# Altium project 光照度计.PrjPCB
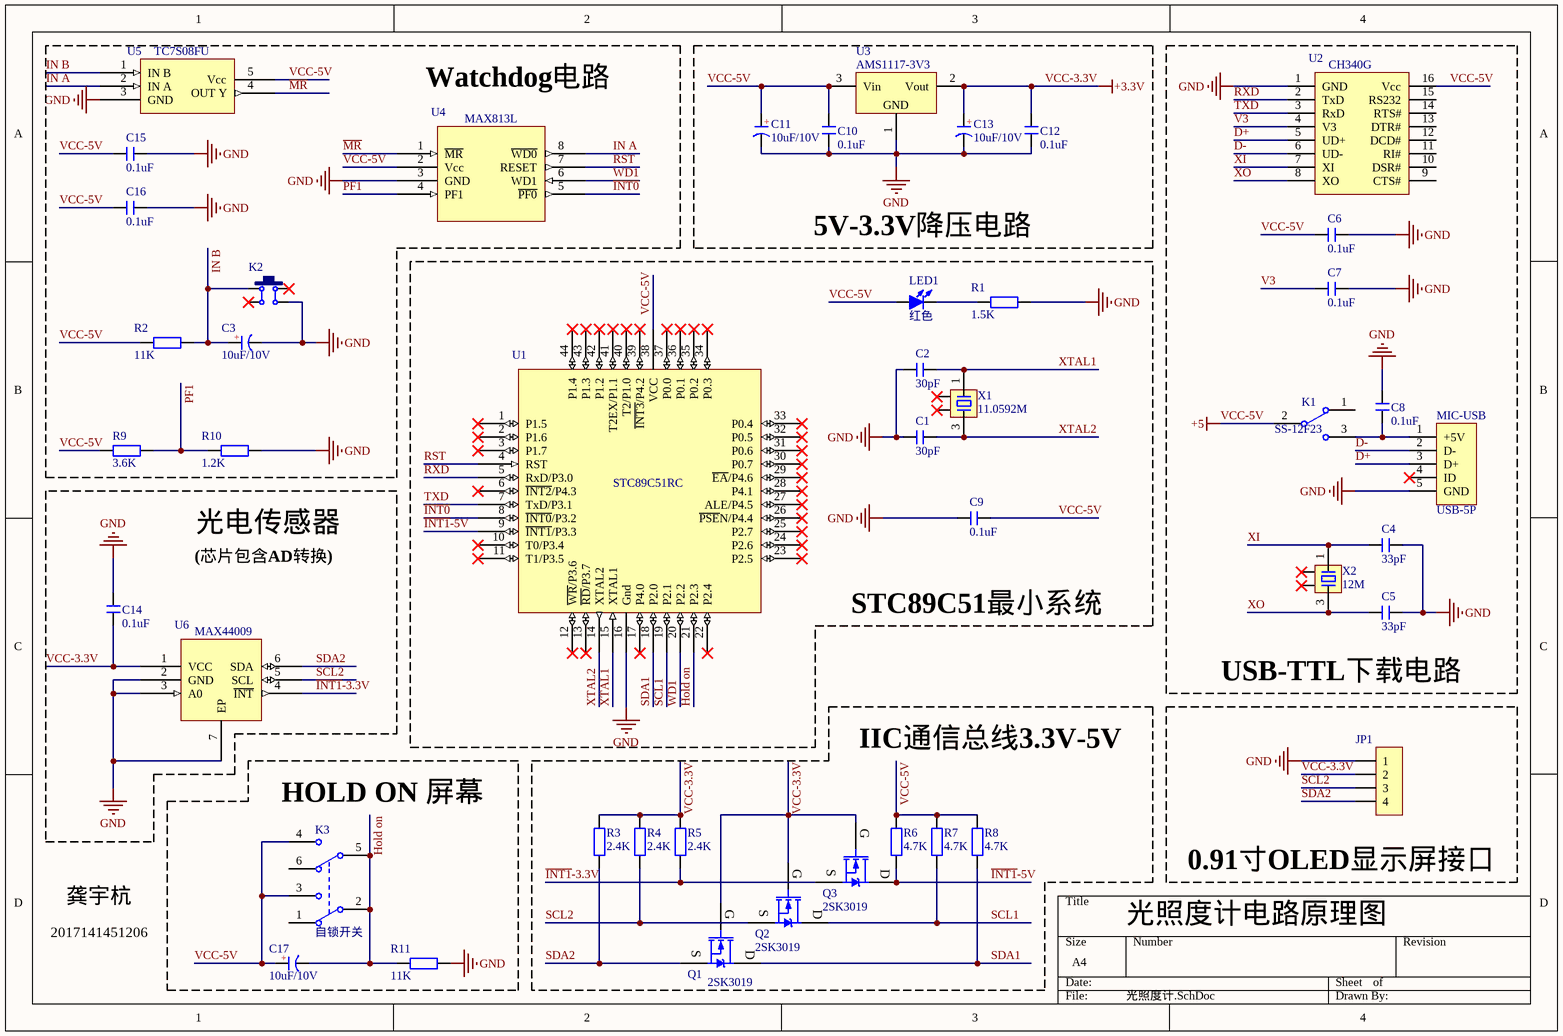
[diagram p0: 光照度计.SchDoc]
1 sheet, 45 parts. Net scope: global (net labels, ports and power ports of the same name join across sheets).
Board file: 光照度计.PcbDoc

## Sheet 光照度计.SchDoc
size A4

### Parts
C1  30pF  [C 0805_L]
C2  30pF  [C 0805_L]
C3  10uF/10V  [CM A(3*5.4)]
C4  33pF  [C 0805_L]
C5  33pF  [C 0805_L]
C6  0.1uF  [C 0805_L]
C7  0.1uF  [C 0805_L]
C8  0.1uF  [C 0805_L]
C9  0.1uF  [C 0805_L]
C10  0.1uF  [C 0805_L]
C11  10uF/10V  [CM A(3*5.4)]
C12  0.1uF  [C 0805_L]
C13  10uF/10V  [CM A(3*5.4)]
C14  0.1uF  [C 0805_L]
C15  0.1uF  [C 0805_L]
C16  0.1uF  [C 0805_L]
C17  10uF/10V  [CM A(3*5.4)]
JP1  HDR-1X4  [HDR2.54-M-LI-4P]  (value not drawn)
K1  SS-12F23  [MSK-12C01-07]
K2  6x6x5  [TSW SMD-6*6*4.3]  (value not drawn)
K3  自锁开关  [KFT DIP-7X7]
LED1  红色  [LED 0805G]
MIC-USB  USB-5P  [USB-MICRO_A]
Q1  2SK3019  [SOT523]
Q2  2SK3019  [SOT523]
Q3  2SK3019  [SOT523]
R1  1.5K  [R 0805_L]
R2  11K  [R 0805_L]
R3  2.4K  [R 0805_L]
R4  2.4K  [R 0805_L]
R5  2.4K  [R 0805_L]
R6  4.7K  [R 0805_L]
R7  4.7K  [R 0805_L]
R8  4.7K  [R 0805_L]
R9  3.6K  [R 0805_L]
R10  1.2K  [R 0805_L]
R11  11K  [R 0805_L]
U1  STC89C51RC  [LQFP44 10X10_N]
U2  CH340G  [SOP16_N]
U3  AMS1117-3V3  [SOT223_N]
U4  MAX813L  [SOP8-N-MAX813L]
U5  TC7S08FU  [TSOP65P210X100-5M]
U6  MAX44009  [QFN65P200X200X65_HS-7N]
X1  11.0592M  [OSC 3225-4P]
X2  12M  [OSC 3225-4P]

### Nets
GND: C1.1 C2.2 C3.2(K) C4.1 C5.1 C6.1 C7.1 C8.1 C9.1 C10.1 C11.2(K) C12.1 C13.2(K) C14.1 C15.1 C16.1 JP1.1 K2.3 MIC-USB.5(GND) R1.2 R10.2 R11.2 U1.16(Gnd) U2.1(GND) U3.1(GND) U4.3(GND) U5.3(GND) U6.2(GND) U6.3(A0) U6.7(EP)
VCC-3.3V: C12.2 C13.1(A) C14.2 JP1.2 Q1.1(G) Q2.1(G) Q3.1(G) R3.2 R4.2 R5.2 U3.2(Vout) U6.1(VCC)  [also labelled +3.3V]
VCC-5V: C6.2 C9.2 C10.2 C11.1(A) C15.2 C16.2 C17.1(A) K1.2 K3.3(NO1) K3.4(NO2) LED1.1(A) R2.1 R6.2 R7.2 R8.2 R9.2 U1.38(VCC) U2.16(Vcc) U3.3(Vin) U4.2(Vcc) U5.5(Vcc)  [also labelled +5]
D+: MIC-USB.3(D+) U2.5(UD+)
D-: MIC-USB.2(D-) U2.6(UD-)
Hold on: C17.2(K) K3.2(COM2) K3.5(COM2) R11.1 U1.21(P2.3)
~{INT0}: U1.8(~{INT0}/P3.2) U4.5(~{PF0})
~{INT1}-3.3V: Q3.3(S) R5.1 U6.4(~{INT})
~{INT1}-5V: Q3.2(D) R6.1 U1.9(~{INT1}/P3.3)
IN A: U4.8(~{WD0}) U5.2(IN_A)
IN B: C3.1(A) K2.1 R2.2 U5.1(IN_B)
~{MR}: U4.1(~{MR}) U5.4(OUT_Y)
PF1: R9.1 R10.1 U4.4(PF1)
RST: U1.4(RST) U4.7(RESET)
RXD: U1.5(RxD/P3.0) U2.2(TxD)
SCL1: Q2.2(D) R7.1 U1.19(P2.1)
SCL2: JP1.3 Q2.3(S) R4.1 U6.5(SCL)
SDA1: Q1.2(D) R8.1 U1.18(P2.0)
SDA2: JP1.4 Q1.3(S) R3.1 U6.6(SDA)
TXD: U1.7(TxD/P3.1) U2.3(RxD)
V3: C7.2 U2.4(V3)
WD1: U1.20(P2.2) U4.6(WD1)
XI: C4.2 U2.7(XI) X2.1
XO: C5.2 U2.8(XO) X2.3
XTAL1: C2.1 U1.15(XTAL1) X1.1
XTAL2: C1.2 U1.14(XTAL2) X1.3
NetC8_2: C8.2 K1.3 MIC-USB.1(+5V)
NetLED1_2: LED1.2(K) R1.1

Not connected (* = marked no-connect by the designer): K1 1; K2 2* 4*; K3 1(NC1) 6(NC2); MIC-USB 4(ID)*; U1 1(P1.5)* 2(P1.6)* 3(P1.7)* 6(~{INT2}/P4.3)* 10(T0/P3.4)* 11(T1/P3.5)* 12(~{WR}/P3.6)* 13(~{RD}/P3.7)* 17(P4.0)* 22(P2.4)* 23(P2.5)* 24(P2.6)* 25(P2.7)* 26(~{PSE}N/P4.4)* 27(ALE/P4.5)* 28(P4.1)* 29(~{EA}/P4.6)* 30(P0.7)* 31(P0.6)* 32(P0.5)* 33(P0.4)* 34(P0.3)* 35(P0.2)* 36(P0.1)* 37(P0.0)* 39(~{INT3}/P4.2)* 40(T2/P1.0)* 41(T2EX/P1.1)* 42(P1.2)* 43(P1.3)* 44(P1.4)*; U2 9(CTS#) 10(DSR#) 11(RI#) 12(DCD#) 13(DTR#) 14(RTS#) 15(RS232); X1 2* 4*; X2 2* 4*

### Notes on the sheet
- Watchdog电路
- 5V-3.3V降压电路
- 光电传感器
- (芯片包含AD转换)
- STC89C51最小系统
- (near C5) USB-TTL下载电路
- IIC通信总线3.3V-5V
- (near K3) HOLD ON 屏幕
- 龚宇杭
- (near JP1) 0.91寸OLED显示屏接口
- 2017141451206
- 光照度计电路原理图
- (in symbol C-CM) +

### Library data of the parts
C1 C2 C4-C10 C12 C14-C16 = C: 贴片电容; BOM名称: 无极性贴片电容; 淘宝ID: 封装库来自淘宝 ID：黄晶宝石; 联系售后，技术支持: https://shop463601444.taobao.com; 唯一出售店铺网址: https://shop463601444.taobao.com
C3 C11 C13 C17 = C-CM: 贴片电解电容; 版权归属: 封装库来自淘宝 ID：黄晶宝石; BOM名称: 贴片电解电容; 联系售后: https://shop463601444.taobao.com
JP1 = Header 4: 4P接插件; 版权归属: 封装库来自淘宝 ID：黄晶宝石; BOM名称: 4P接插件; 学习资源: https://shop463601444.taobao.com
K1 = SSW-1P: 1路波动开关; BOM名称: 波动开关; 版权归属: 封装库来自淘宝 ID：黄晶宝石; 学习资源: https://shop463601444.taobao.com
K2 = TSW SMD-6x6: 贴片6x6轻触开关; 版权归属: 封装库来自淘宝 ID：黄晶宝石; BOM名称: 贴片6x6轻触开关; 唯一出售店铺网址: https://shop463601444.taobao.com
K3 = KET 7X7: 7*7自锁开关; 版权归属: 封装库来自淘宝 ID：黄晶宝石; BOM名称: 7*7自锁开关; 学习资源: https://shop463601444.taobao.com
LED1 = LED-SMD: 贴片LED; 版权归属: 封装库来自淘宝 ID：黄晶宝石; BOM名称: 贴片LED; 学习资源: https://shop463601444.taobao.com
MIC-USB = USB-5P: 微型USB母座; BOM名称: 微型USB母座; 学习资源: https://shop463601444.taobao.com
Q1-Q3 = 2SK3019: N沟场效应管
R1-R11 = R: 贴片电阻; 版权归属: 来自淘宝 ID：黄晶宝石; 封装库来自淘宝卖家 ID：黄晶宝石: 其他店铺购入均为盗版，不享受售后技术支持服务，请立即申请退款; BOM名称: 贴片电阻; 联系售后: https://shop463601444.taobao.com
U1 = STC89C51RC-44pin: STC单片机贴片
U2 = CH340G: 串口转USB; 版权归属: 封装库来自淘宝 ID：黄晶宝石; BOM名称: 串口转USB; 学习资源: https://shop463601444.taobao.com
U3 = AMS1117: 三端稳压芯片; BOM名称: 稳压芯片; 淘宝ID: 封装库来自淘宝 ID：黄晶宝石; 欢迎光临淘宝店铺: https://shop463601444.taobao.com
U4 = MAX813L: 电源监控芯片（看门狗）
U5 = TC7S08FU-2输入与门: 2输入与门（一个）
U6 = MAX44009: 光照度传感器
X1 X2 = XTAL-4P: 4脚无源晶振; 版权归属: 封装库来自淘宝卖家 ID：黄晶宝石; BOM名称: 4脚无源晶振; 学习资源: https://shop463601444.taobao.com